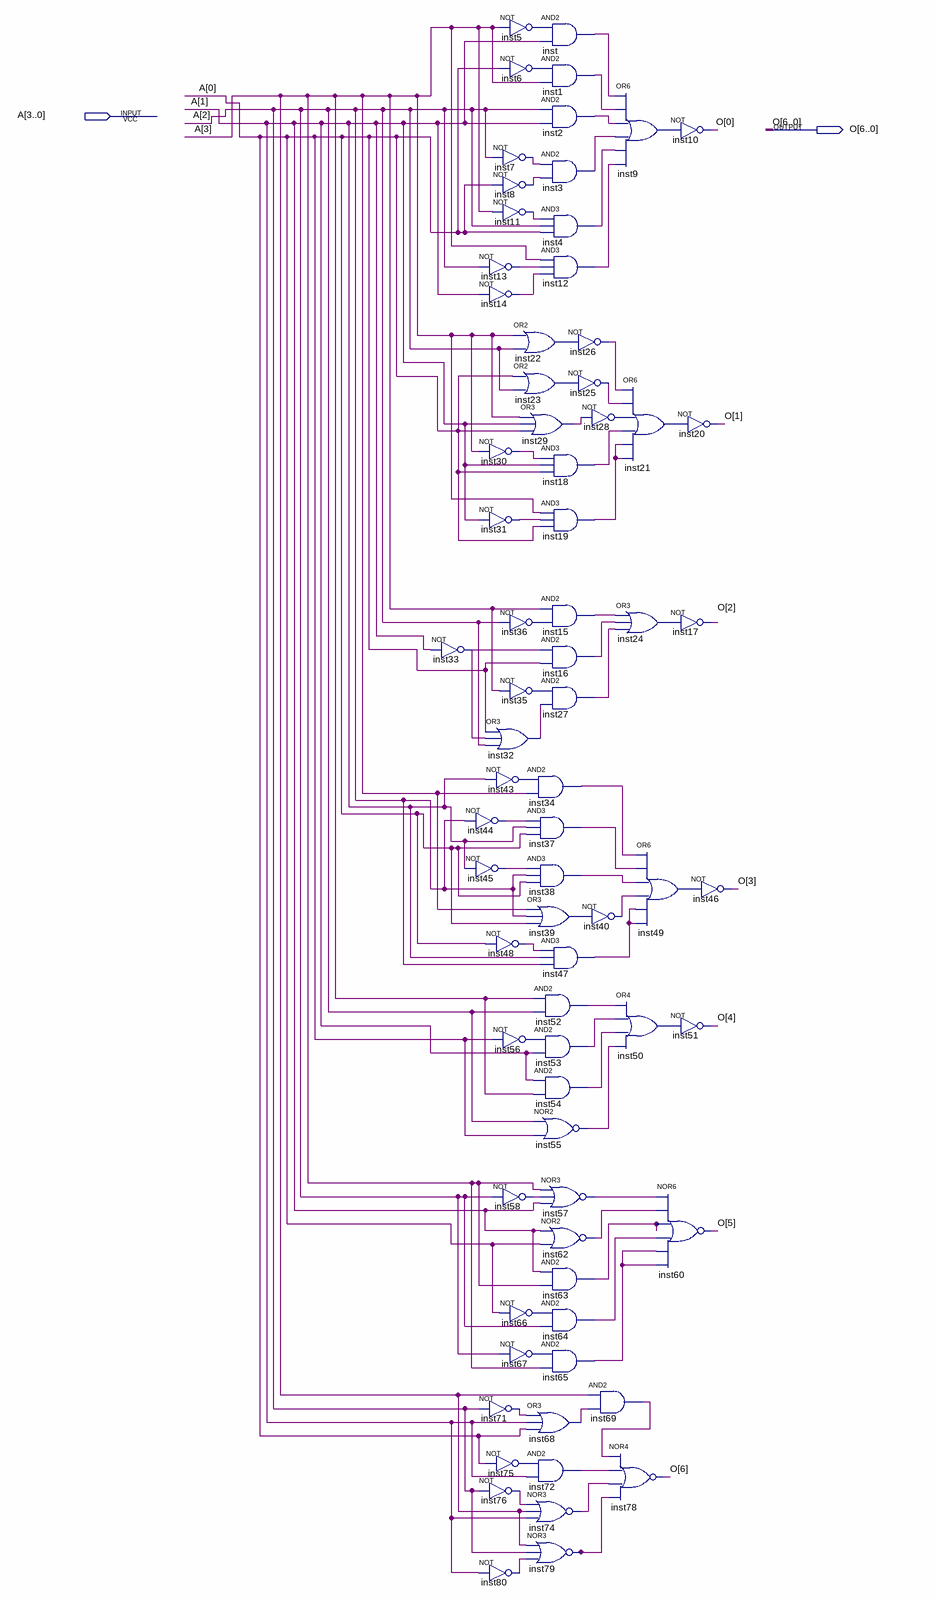
[diagram p0: schematic sheet]
// Quartus schematic DISPLAY.bdf as structural Verilog: 74 symbols, 2 pins
module DISPLAY (
  input  [3:0] A,
  output [6:0] O
);

  wire inst1_out, inst2_out, inst3_out, inst4_out, inst5_out, inst6_out, inst7_out, inst8_out, inst9_out,
       inst11_out, inst12_out, inst13_out, inst14_out, inst15_out, inst16_out, inst18_out, inst19_out,
       inst21_out, inst22_out, inst23_out, inst24_out, inst25_out, inst26_out, inst27_out, inst28_out,
       inst29_out, inst30_out, inst31_out, inst32_out, inst33_out, inst34_out, inst35_out, inst36_out,
       inst37_out, inst38_out, inst39_out, inst40_out, inst43_out, inst44_out, inst45_out, inst47_out,
       inst48_out, inst49_out, inst50_out, inst52_out, inst53_out, inst54_out, inst55_out, inst56_out,
       inst57_out, inst58_out, inst62_out, inst63_out, inst64_out, inst65_out, inst66_out, inst67_out,
       inst68_out, inst69_out, inst71_out, inst72_out, inst74_out, inst75_out, inst76_out, inst79_out,
       inst80_out, inst_out;

  not inst33 (inst33_out, A[1]);
  not inst5 (inst5_out, A[3]);
  not inst6 (inst6_out, A[0]);
  not inst7 (inst7_out, A[2]);
  not inst8 (inst8_out, A[0]);
  not inst11 (inst11_out, A[3]);
  not inst13 (inst13_out, A[2]);
  not inst14 (inst14_out, A[1]);
  not inst30 (inst30_out, A[3]);
  not inst31 (inst31_out, A[1]);
  not inst36 (inst36_out, A[2]);
  not inst35 (inst35_out, A[3]);
  or inst32 (inst32_out, A[0], inst33_out, A[2]);
  not inst43 (inst43_out, A[1]);
  not inst44 (inst44_out, A[2]);
  not inst45 (inst45_out, A[1]);
  not inst48 (inst48_out, A[0]);
  not inst56 (inst56_out, A[0]);
  not inst58 (inst58_out, A[2]);
  not inst66 (inst66_out, A[0]);
  not inst67 (inst67_out, A[2]);
  not inst71 (inst71_out, A[2]);
  not inst75 (inst75_out, A[0]);
  not inst76 (inst76_out, A[2]);
  not inst80 (inst80_out, A[1]);
  and inst (inst_out, inst5_out, A[1]);
  and inst1 (inst1_out, inst6_out, A[3]);
  and inst2 (inst2_out, A[2], A[1]);
  and inst3 (inst3_out, inst7_out, inst8_out);
  and inst4 (inst4_out, inst11_out, A[2], A[0]);
  and inst12 (inst12_out, A[3], inst13_out, inst14_out);
  or inst22 (inst22_out, A[3], A[2]);
  or inst23 (inst23_out, A[0], A[2]);
  or inst29 (inst29_out, A[3], A[1], A[0]);
  and inst18 (inst18_out, inst30_out, A[1], A[0]);
  and inst19 (inst19_out, A[3], inst31_out, A[0]);
  and inst15 (inst15_out, A[3], inst36_out);
  and inst16 (inst16_out, inst33_out, A[0]);
  and inst27 (inst27_out, inst35_out, inst32_out);
  and inst34 (inst34_out, inst43_out, A[3]);
  and inst37 (inst37_out, inst44_out, A[1], A[0]);
  and inst38 (inst38_out, inst45_out, A[2], A[0]);
  or inst39 (inst39_out, A[3], A[2], A[0]);
  and inst47 (inst47_out, inst48_out, A[1], A[2]);
  and inst52 (inst52_out, A[3], A[2]);
  and inst53 (inst53_out, inst56_out, A[1]);
  and inst54 (inst54_out, A[1], A[3]);
  nor inst55 (inst55_out, A[2], A[0]);
  nor inst57 (inst57_out, A[3], inst58_out, A[1]);
  nor inst62 (inst62_out, A[1], A[0]);
  and inst63 (inst63_out, A[1], A[3]);
  and inst64 (inst64_out, inst66_out, A[2]);
  and inst65 (inst65_out, inst67_out, A[3]);
  or inst68 (inst68_out, inst71_out, A[1], A[0]);
  and inst72 (inst72_out, inst75_out, A[1]);
  nor inst74 (inst74_out, inst76_out, A[3], A[1]);
  nor inst79 (inst79_out, A[3], A[2], inst80_out);
  or inst9 (inst9_out, inst_out, inst1_out, inst2_out, inst3_out, inst4_out, inst12_out);
  not inst26 (inst26_out, inst22_out);
  not inst25 (inst25_out, inst23_out);
  not inst28 (inst28_out, inst29_out);
  or inst24 (inst24_out, inst15_out, inst16_out, inst27_out);
  not inst40 (inst40_out, inst39_out);
  or inst50 (inst50_out, inst52_out, inst53_out, inst54_out, inst55_out);
  and inst69 (inst69_out, A[3], inst68_out);
  nor inst78 (O[6], inst69_out, inst72_out, inst74_out, inst79_out);
  not inst10 (O[0], inst9_out);
  or inst21 (inst21_out, inst26_out, inst25_out, inst28_out, inst18_out, inst19_out, inst19_out);
  not inst17 (O[2], inst24_out);
  or inst49 (inst49_out, inst34_out, inst37_out, inst38_out, inst40_out, inst47_out, inst47_out);
  not inst51 (O[4], inst50_out);
  nor inst60 (O[5], inst57_out, inst62_out, inst63_out, inst64_out, inst65_out, inst65_out);
  not inst20 (O[1], inst21_out);
  not inst46 (O[3], inst49_out);
endmodule
